# EAGLE design ProtoShield-I2C-PW-1.0.b (EAGLE 5.10)
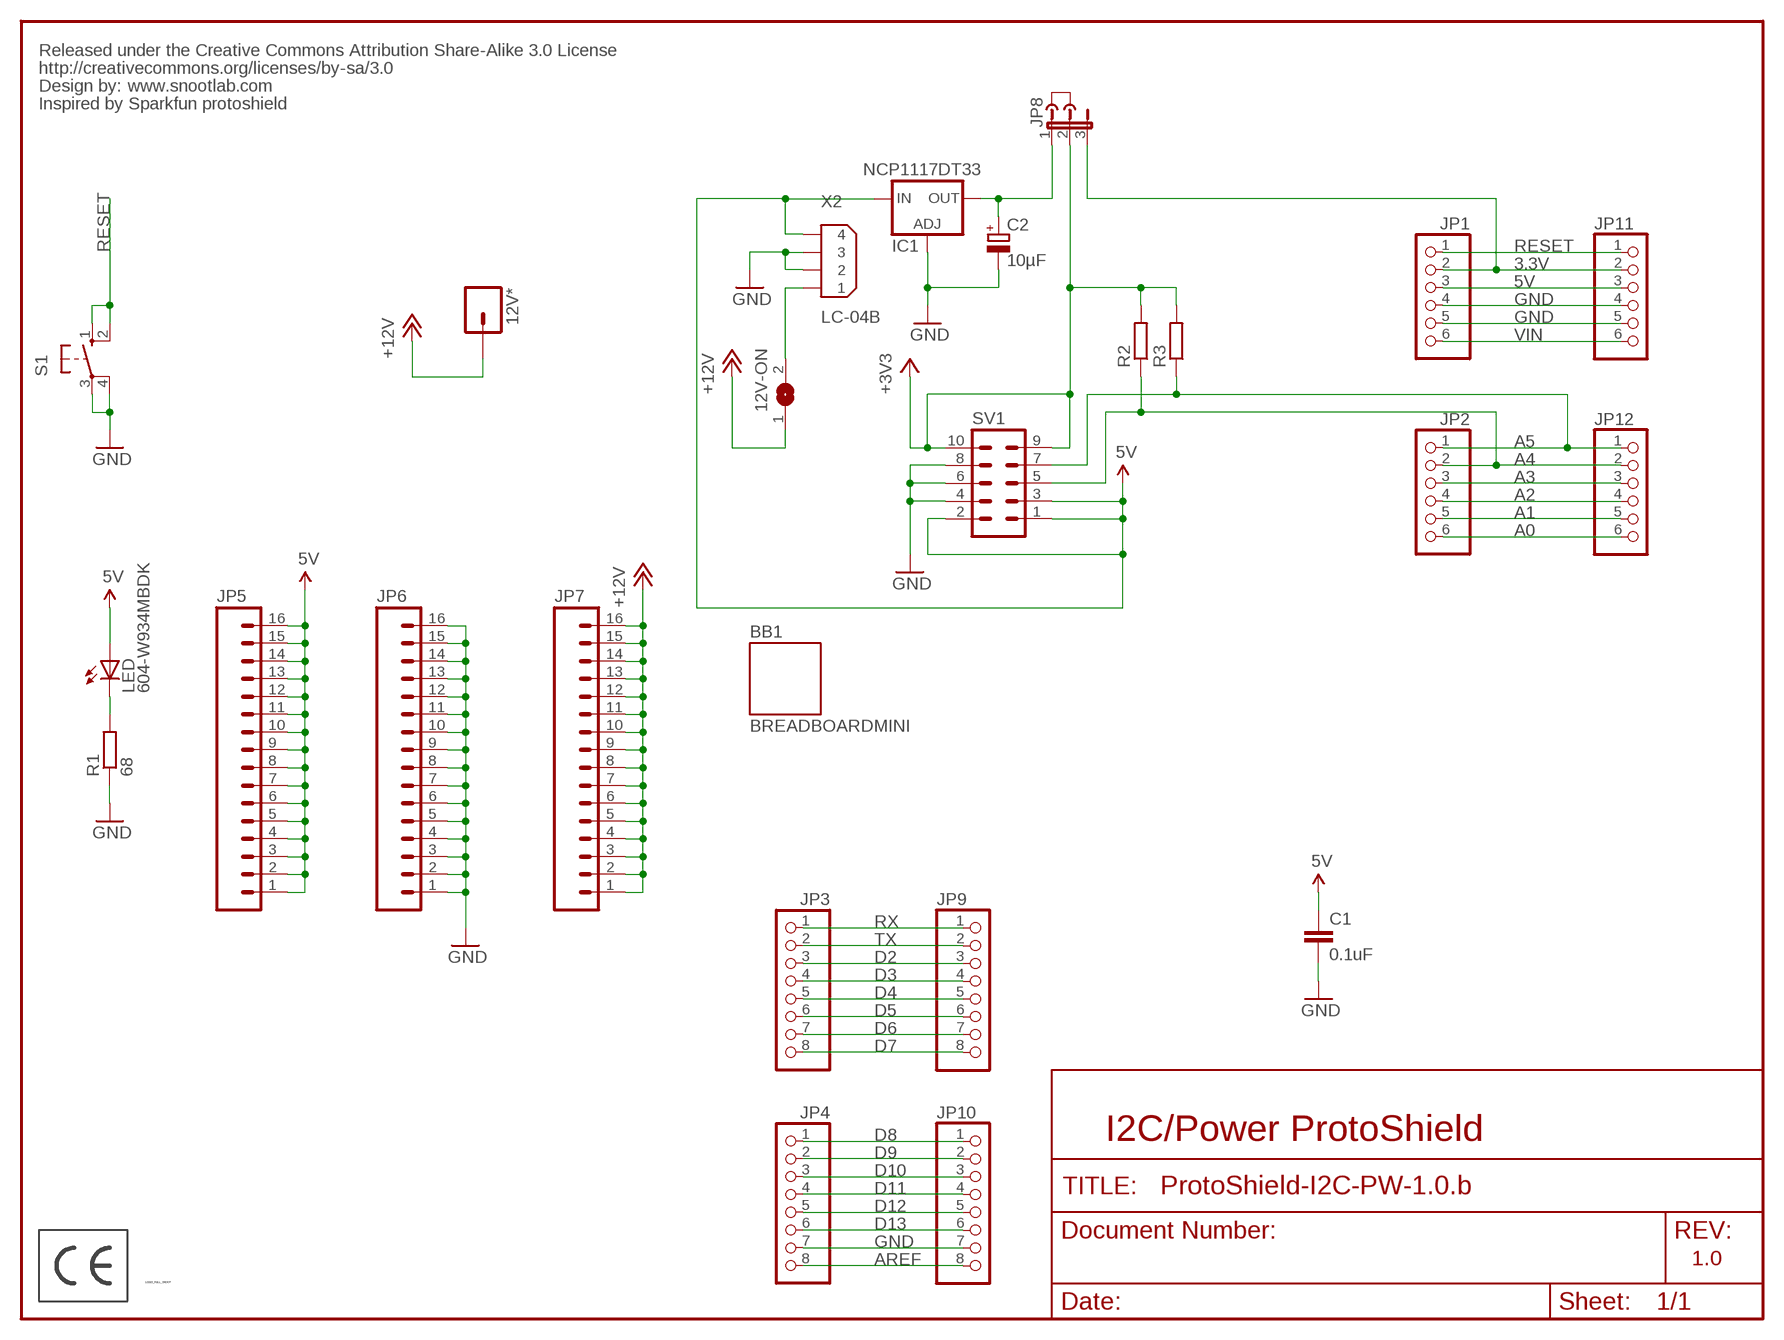
[diagram p0: schematic, sheet 1]

## Parts
12V*  M01PTH  [1X01]
12V-ON  SJ  [SJ]
BB1  BREADBOARDMINI  [BREADBOARD-MINI]
C1  0.1uF  C-EU050-025X075  [C050-025X075]
C2  10µF  CPOL-EUE2-5  [E2-5]
IC1  NCP1117DT33  LD117ADT-TR  [DPACK]
J1  JUMPER  [JUMP]
JP1  PINHD-1X6NOPIN  [1X06_NOPIN]
JP2  PINHD-1X6NOPIN  [1X06_NOPIN]
JP3  PINHD-1X8NOPIN  [1X08_NOPIN]
JP4  PINHD-1X8NOPIN  [1X08_NOPIN]
JP5  M16NOPIN  [1X16_NOPIN]
JP6  M16NOPIN  [1X16_NOPIN]
JP7  M16NOPIN  [1X16_NOPIN]
JP8  JP2E  [JP2]
JP9  PINHD-1X8/STACK  [1X08_STACK]
JP10  PINHD-1X8/STACK  [1X08_STACK]
JP11  PINHD-1X6/STACK  [1X06_STACK]
JP12  PINHD-1X6/STACK  [1X06_STACK]
LED  604-W934MBDK  LED3MM  [LED3MM]
R1  68  R-EU_0207/7  [0207/7]
R2  R-EU_0207/2V  [0207/2V]
R3  R-EU_0207/2V  [0207/2V]
S1  10-XX  [B3F-10XX]
SV1  ML10L  [ML10L]
U$1  CE_LOGO  [CE6.35X5.08_TOP]
U$2  LOGO_SNOOTLABH6.35  [LOGO_SNOOT_H6.35]
U$3  LOGO_SNOOTLABFULL_H5  [LOGO_SNOOT_FULL_H5]
U$5  CREATIVE_COMMONS  [CREATIVE_COMMONS]
X2  LC-04B  [LC-04B]

## Nets
3.3V: JP1.2 JP8.3 JP11.2
5V [power]: C1.1 IC1.3(IN) JP1.3 JP5.1 JP5.2 JP5.3 JP5.4 JP5.5 JP5.6 JP5.7 JP5.8 JP5.9 JP5.10 JP5.11 JP5.12 JP5.13 JP5.14 JP5.15 JP5.16 JP11.3 LED.A SV1.1 SV1.2 SV1.3 X2.4
+3V3: JP8.2 R2.2 R3.2 SV1.9 SV1.10
+12V [power]: 12V*.1 12V-ON.1 JP7.1 JP7.2 JP7.3 JP7.4 JP7.5 JP7.6 JP7.7 JP7.8 JP7.9 JP7.10 JP7.11 JP7.12 JP7.13 JP7.14 JP7.15 JP7.16
A0: JP2.6 JP12.6
A1: JP2.5 JP12.5
A2: JP2.4 JP12.4
A3: JP2.3 JP12.3
A4: JP2.2 JP12.2 R2.1 SV1.5
A5: JP2.1 JP12.1 R3.1 SV1.7
AREF: JP4.8 JP10.8
D2: JP3.3 JP9.3
D3: JP3.4 JP9.4
D4: JP3.5 JP9.5
D5: JP3.6 JP9.6
D6: JP3.7 JP9.7
D7: JP3.8 JP9.8
D8: JP4.1 JP10.1
D9: JP4.2 JP10.2
D10: JP4.3 JP10.3
D11: JP4.4 JP10.4
D12: JP4.5 JP10.5
D13: JP4.6 JP10.6
GND [power]: C1.2 C2.- IC1.1(ADJ) JP1.4 JP1.5 JP4.7 JP6.1 JP6.2 JP6.3 JP6.4 JP6.5 JP6.6 JP6.7 JP6.8 JP6.9 JP6.10 JP6.11 JP6.12 JP6.13 JP6.14 JP6.15 JP6.16 JP10.7 JP11.4 JP11.5 R1.1 S1.3(P) S1.4(P1) SV1.4 SV1.6 SV1.8 X2.2 X2.3
N$3 [power]: 12V-ON.2 X2.1
N$6: LED.K(C) R1.2
N$7: C2.+ IC1.4(OUT) JP8.1
RESET: JP1.1 JP11.1 S1.1(S) S1.2(S1)
RX: JP3.1 JP9.1
TX: JP3.2 JP9.2
VIN [power]: JP1.6 JP11.6

## Notes on the sheet
- www.snootlab.com
- Inspired by Sparkfun protoshield
- I2C/Power ProtoShield
- 1.0

## Library data of the parts
12V* = SparkFun:M01: Header 1 Standard 1-pin 0.1" header. Use with straight break away headers (SKU : PRT-00116), right angle break away headers (PRT-00553), swiss pins (PRT-00743), machine pins (PRT-00117), and female headers (PRT-00115).
12V-ON = jumper:SJ: SMD solder JUMPER
BB1 = SparkFun:BREADBOARD: Breadboard Mini Self Adhesive This is the mechnical outline for the very small self adhesive breadboard from SparkFun Electronics. Good for very small proto areas. SKU : PRT-07916
C1 = rcl:C-EU: CAPACITOR, European symbol
C2 = rcl:CPOL-EU: POLARIZED CAPACITOR, European symbol
IC1 = v-reg:LD117A?*: Low drop fixed and adjustable positive voltage regulators 1 A Source: http://www.st.com/stonline/products/literature/ds/7194/ld1117axx.pdf
J1 = jumper:JUMPER: JUMPER header
JP1 JP2 JP11 JP12 = SnootLib:PINHD-1X6: PIN HEADER
JP3 JP4 JP9 JP10 = SnootLib:PINHD-1X8: PIN HEADER
JP5-JP7 = SnootLib:M16
JP8 = jumper:JP2E: JUMPER
LED = SparkFun:LED: LEDs Standard schematic elements and footprints for 5mm, 3mm, 1206, and 0603 sized LEDs. 5mm - Spark Fun Electronics SKU : COM-00529 (and others)
R1-R3 = rcl:R-EU_: RESISTOR, European symbol
S1 = switch-omron:10-XX: OMRON SWITCH
SV1 = con-harting-ml:ML10: HARTING
U$1 = SnootLib:CE_LOGO: Logo CE
U$2 U$3 = SnootLib:LOGO_SNOOTLAB
U$5 = SnootLib:CREATIVE_COMMONS
X2 = SnootLib:LC-04: Disk Drive Power four position Source: JST LC Connector

## Net classes
1 power: width 0.254 mm

## Board
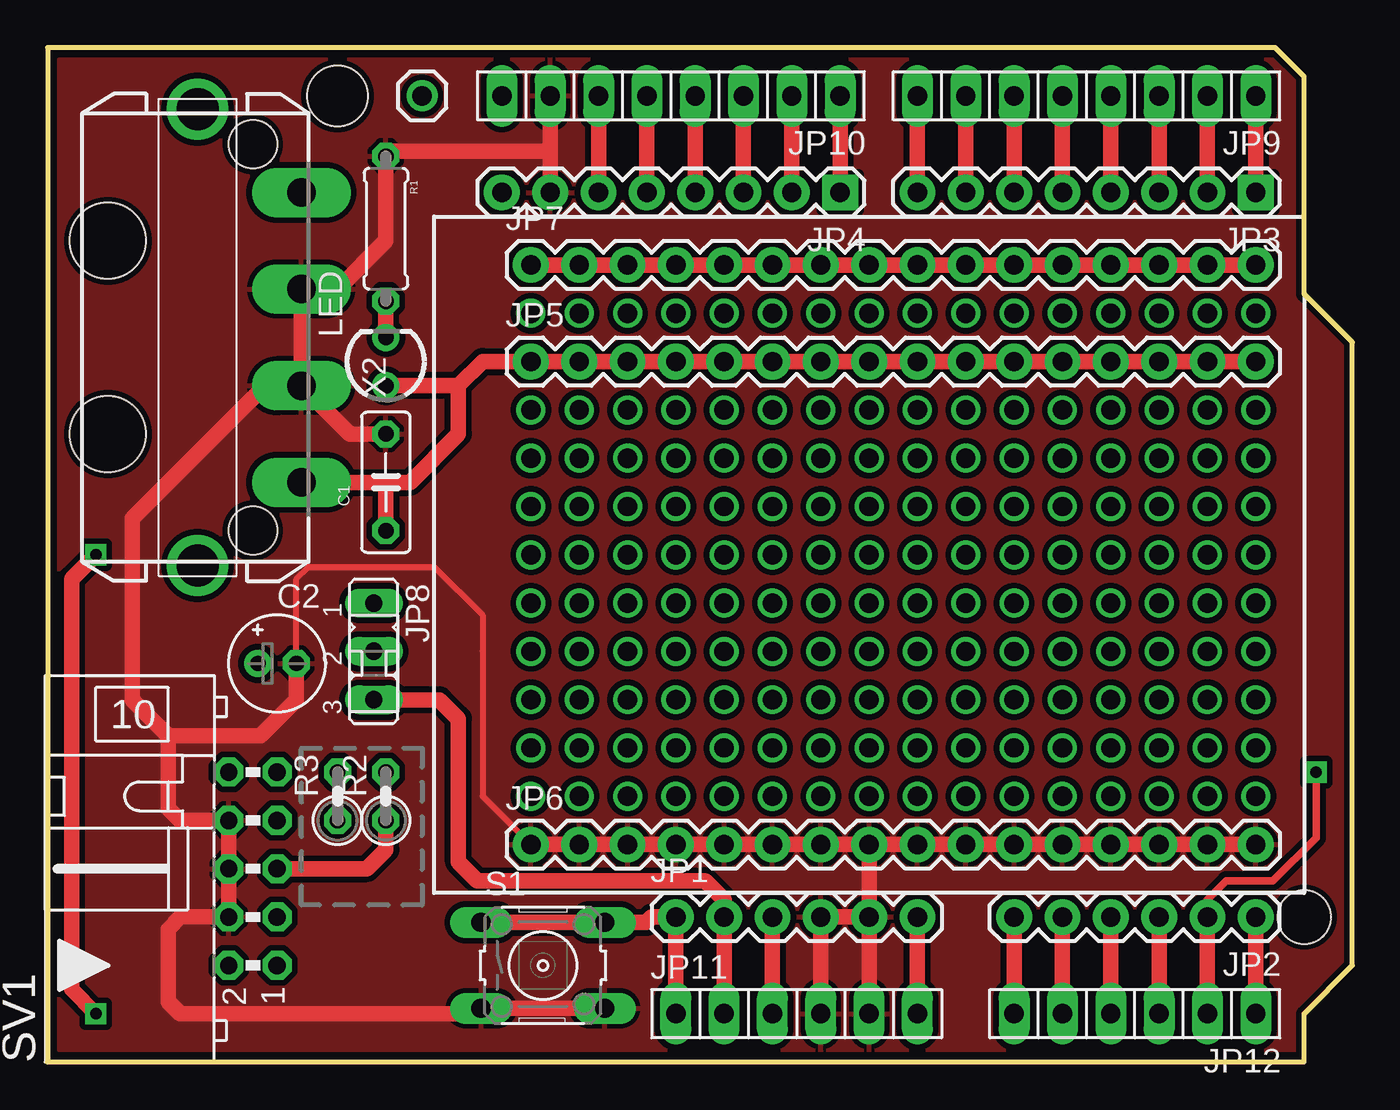
[diagram p1: board, top side]
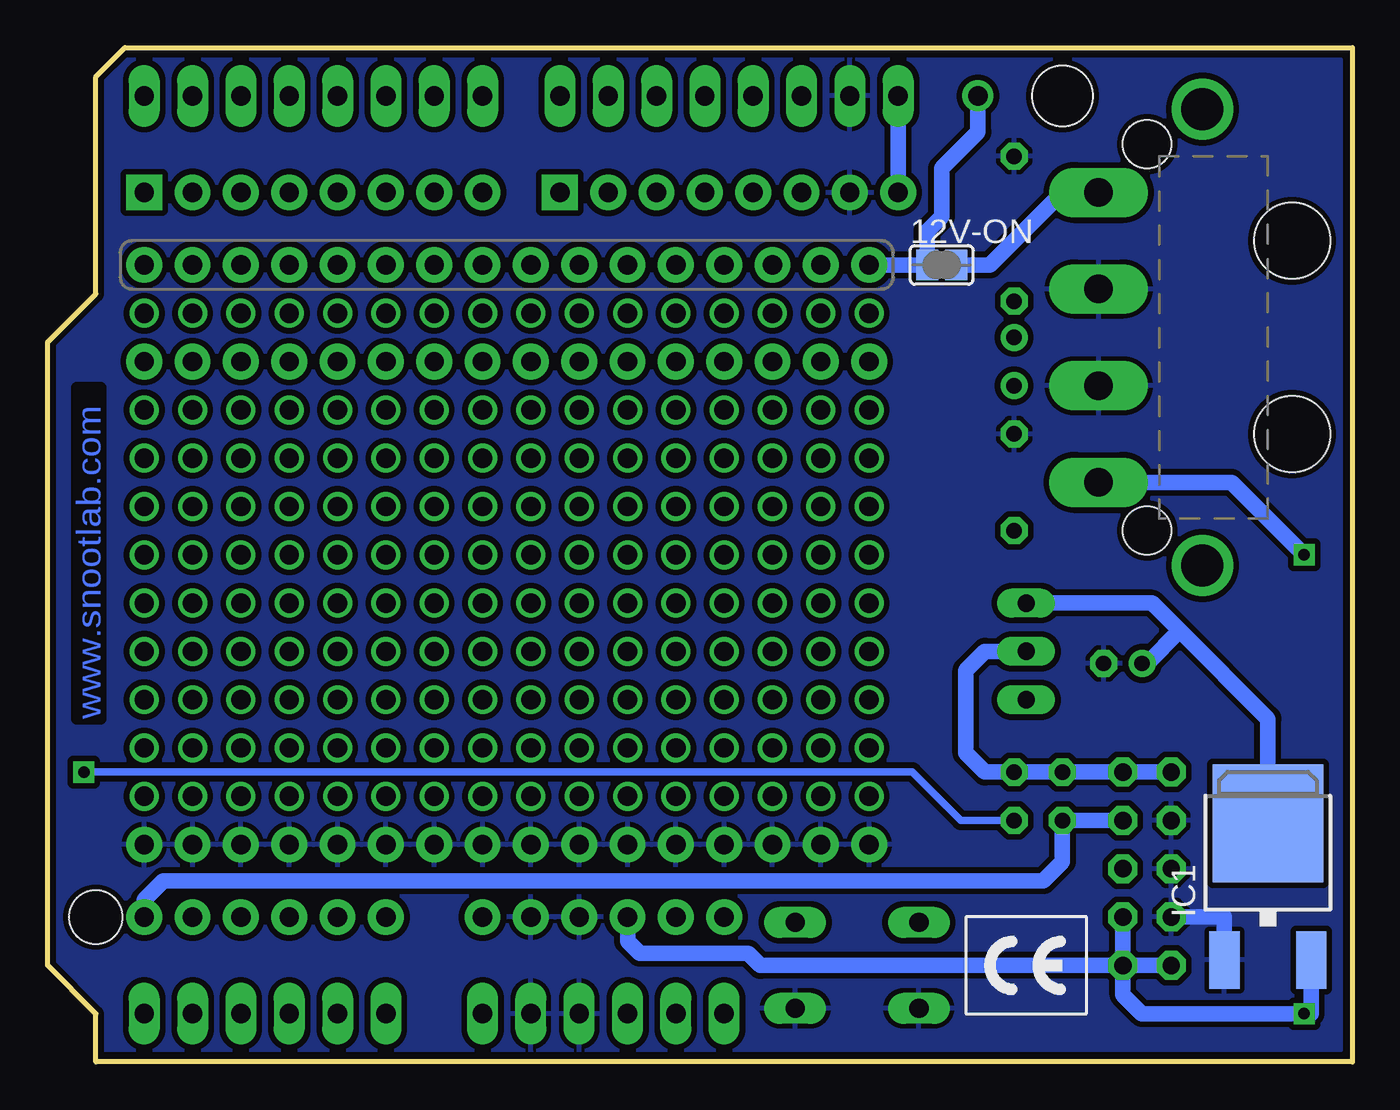
[diagram p2: board, bottom side, seen from below]

Size 68.58 x 53.34 mm. Coordinates in mm from the lower left corner, seen from the top.
Outline: 0,0 66.04,0 66.04,2.54 68.58,5.08 68.58,37.85 66.04,40.39 66.04,51.82 64.52,53.34 0,53.34 0,0
Copper layers (1*16): Top 0.035mm / dielectric 1.5mm / Bottom 0.035mm
Design rules "SparkFun": minimum track width 8mil, minimum drill 20mil, track to track 8mil, track to pad 8mil, pad to pad 8mil, via to via 8mil, smd to smd 8mil, copper to edge 10mil, drill to drill 8mil, minimum pad ring 12mil, minimum via ring 10mil, stop-mask expansion 4mil, vias tented up to drill 25mil, thermal gap 10mil
Holes 2.8 mm at 66.04,7.62
Holes 3.2 mm at 15.24,50.8
Holes 4 mm at 3.17,43.18 3.17,33.02
Holes 2.54 mm at 10.79,27.94 10.79,48.26

### Footprints (pad centres in the part's own frame; a part is rotated, then mirrored left to right if it is on the bottom)
1X01 = drill 1.016 round: 1 0,0
SJ = smd 1.168 x 1.6: 1 -0.762,0; 2 0.762,0
C050-025X075 = drill 0.813 octagon: 1 -2.54,0; 2 2.54,0
E2-5 = drill 0.813 pad 1.27 round: + -1.016,0 | drill 0.813 pad 1.27 octagon: - 1.016,0
DPACK = smd 1.6 x 3: 1 -2.28,-4.8; 3 2.28,-4.8 | smd 5.8 x 6.2: 4 0,2.38
1X06_NOPIN = drill 1.016 pad 1.88 round: 1 0,0; 2 2.54,0; 3 5.08,0; 4 7.62,0; 5 10.16,0; 6 12.7,0
1X08_NOPIN = drill 1.016 pad 1.88 square: 1 0,0 | drill 1.016 pad 1.88 round: 2 2.54,0; 3 5.08,0; 4 7.62,0; 5 10.16,0; 6 12.7,0; 7 15.24,0; 8 17.78,0
1X16_NOPIN = drill 1.016 pad 1.88 round: 1 0,0; 2 2.54,0; 3 5.08,0; 4 7.62,0; 5 10.16,0; 6 12.7,0; 7 15.24,0; 8 17.78,0; 9 20.32,0; 10 22.86,0; 11 25.4,0; 12 27.94,0; 13 30.48,0; 14 33.02,0; 15 35.56,0; 16 38.1,0
JP2 = drill 0.914 long: 1 -2.54,0; 2 0,0; 3 2.54,0
1X08_STACK = drill 1.016 long: 1 -8.89,0; 2 -6.35,0; 3 -3.81,0; 4 -1.27,0; 5 1.27,0; 6 3.81,0; 7 6.35,0; 8 8.89,0
1X06_STACK = drill 1.016 long: 1 -6.35,0; 2 -3.81,0; 3 -1.27,0; 4 1.27,0; 5 3.81,0; 6 6.35,0
LED3MM = drill 0.813 round: A -1.27,0; K 1.27,0
0207/7 = drill 0.813 octagon: 1 -3.81,0; 2 3.81,0
0207/2V = drill 0.813 octagon: 1 -1.27,0; 2 1.27,0
B3F-10XX = drill 1.016 long: 1 -3.251,2.261; 2 3.251,2.261; 3 -3.251,-2.261; 4 3.251,-2.261
ML10L = drill 0.914 octagon: 1 -5.08,-1.27; 2 -5.08,1.27; 3 -2.54,-1.27; 4 -2.54,1.27; 5 0,-1.27; 6 0,1.27; 7 2.54,-1.27; 8 2.54,1.27; 9 5.08,-1.27; 10 5.08,1.27
LC-04B = drill 1.5 pad 2.6 long: 1 7.62,0; 2 2.54,0; 3 -2.54,0; 4 -7.62,0 | drill 2.2 round: P$1 12,5.45; P$2 -12,5.45

### Placement (x,y rotation side)
12V*  19.68,50.8 0 top
12V-ON  21.59,41.91 0 bottom
BB1  20.32,8.89 0 top
C1  17.78,30.48 90 top
C2  12.06,20.95 0 top
IC1  4.45,10.16 0 bottom
J1  17.14,20.95 180 top
JP1  33.02,7.62 0 top
JP2  63.5,7.62 180 top
JP3  63.5,45.72 180 top
JP4  41.66,45.72 180 top
JP5  25.4,36.83 0 top
JP6  25.4,11.43 0 top
JP7  25.4,41.91 0 top
JP8  17.14,21.59 270 top
JP9  54.61,50.8 180 top
JP10  32.77,50.8 180 top
JP11  39.37,2.54 0 top
JP12  57.15,2.54 180 top
LED  17.78,36.83 90 top
R1  17.78,43.81 270 top
R2  17.78,13.97 90 top
R3  15.24,13.97 90 top
S1  26.04,5.08 0 top
SV1  10.79,10.16 90 top
U$1  20.32,2.54 0 bottom
U$2  13.34,1.27 0 top
U$3  19.68,9.53 90 bottom
U$4  LOGO_SNOOTLABTXT_H1.7  [LOGO_SNOOT_TXT_H1.7]  67.94,17.78 90 top
U$5  2.54,-8.89 0 top  (outside the outline)
X2  13.34,38.1 90 top

### Tracks (layer width: path | path; a pad name or v marks a point on that pad's centre or on a via)
3.3V
  Top 0.813: JP11.2 JP1.2 35.56,8.53 34.56,9.53 22.59,9.53 21.59,10.53 21.59,18.05 20.59,19.05 JP8.3
5V  (via drill 0.6)
  Top 0.813: JP5.16 JP5.15 JP5.14 JP5.13 JP5.12 JP5.11 JP5.10 JP5.9 JP5.8 JP5.7 JP5.6 JP5.5 JP5.4 JP5.3 JP5.2 JP5.1 22.86,36.83 21.59,35.56 | JP1.3 JP11.3 | v2.54,2.54 1.27,3.81 1.27,25.4 v2.54,26.67 | X2.4 17.78,30.48 | 21.59,35.56 21.59,33.02 19.05,30.48 17.78,30.48 | 17.78,30.48 C1.1 | 21.59,35.56 LED.A
  Bottom 0.813: SV1.1 SV1.3 | SV1.1 12.06,3.54 11.06,2.54 v2.54,2.54 2.17,2.54 IC1.3 | SV1.1 SV1.2 | SV1.1 31.11,5.08 31.75,5.71 37.47,5.71 38.1,6.35 JP1.3 | X2.4 6.35,30.48 v2.54,26.67
+3V3
  Bottom 0.813: SV1.10 SV1.9 R3.2 R2.2 19.32,15.24 20.32,16.24 20.32,20.59 19.32,21.59 JP8.2
+12V
  Top 0.813: JP7.16 JP7.15 JP7.14 JP7.13 JP7.12 JP7.11 JP7.10 JP7.9 JP7.8 JP7.7 JP7.6 JP7.5 JP7.4 JP7.3 JP7.2 JP7.1
  Bottom 0.813: JP7.1 12V-ON.1 22.35,43.69 21.59,44.45 21.59,46.99 19.68,48.9 12V*.1
A0
  Top 0.813: JP12.6 JP2.6
A1
  Top 0.813: JP12.5 JP2.5
A2
  Top 0.813: JP12.4 JP2.4
A3
  Top 0.813: JP12.3 JP2.3
A4  (via drill 0.6)
  Top 0.406: JP2.2 60.96,8.53 61.96,9.53 64.41,9.53 66.67,11.79 v66.67,15.24
  Top 0.813: JP2.2 JP12.2 | SV1.5 16.78,10.16 17.78,11.16 R2.1
  Bottom 0.406: R2.1 20.59,12.7 23.13,15.24 v66.67,15.24
A5
  Top 0.813: JP2.1 JP12.1
  Bottom 0.813: SV1.7 R3.1 15.24,10.53 16.24,9.53 62.5,9.53 63.5,8.53 JP2.1
AREF
  Bottom 0.813: JP4.8 JP10.8
D2
  Top 0.813: JP3.3 JP9.3
D3
  Top 0.813: JP3.4 JP9.4
D4
  Top 0.813: JP3.5 JP9.5
D5
  Top 0.813: JP3.6 JP9.6
D6
  Top 0.813: JP3.7 JP9.7
D7
  Top 0.813: JP3.8 JP9.8
D8
  Top 0.813: JP4.1 JP10.1
D9
  Top 0.813: JP4.2 JP10.2
D10
  Top 0.813: JP4.3 JP10.3
D11
  Top 0.813: JP4.4 JP10.4
D12
  Top 0.813: JP4.5 JP10.5
D13
  Top 0.813: JP4.6 JP10.6
GND
  Top 0.305: JP6.1 22.86,13.97 22.86,21.59 22.86,23.5 20.32,26.04 13.72,26.04 13.08,25.4 C2.-
  Top 0.813: 26.42,47.89 JP4.7 | 26.42,47.89 JP10.7 | JP11.4 JP1.4 JP1.5 | JP1.5 JP11.5 | JP6.1 JP6.2 JP6.3 JP6.4 JP6.5 JP6.6 JP6.7 JP6.8 | JP6.8 JP6.9 JP6.10 JP6.11 JP6.12 JP6.13 JP6.14 JP6.15 JP6.16 | 6.35,17.14 6.35,13.34 6.99,12.7 SV1.8 SV1.6 SV1.4 6.99,7.62 6.35,6.99 6.35,3.17 6.99,2.54 22.5,2.54 S1.3 S1.4 | 6.35,17.14 11.18,17.14 13.08,19.05 C2.- | JP6.8 JP1.5 | X2.3 11.43,35.56 4.45,28.57 4.45,19.05 6.35,17.14 | X2.3 X2.2 15.24,40.64 17.78,43.18 R1.1 18.05,47.89 26.42,47.89 | C1.2 15.88,33.02 X2.3
  Bottom 0.813: SV1.4 6.72,7.62 IC1.1
  pour Bottom (isolate 0.305): 0.64,52.7 0.64,0.64 71.12,0.64 71.12,52.7
  pour Top (isolate 0.305): 69.85,52.7 69.85,0.64 0.64,0.64 0.64,52.7
N$3
  Bottom 0.813: 12V-ON.2 19.05,41.91 15.24,45.72 X2.1
N$4  (via drill 1.02)
  other vias: 63.5,39.37
N$5  (via drill 1.02)
  other vias: 63.5,13.97
N$6
  Top 0.813: LED.K R1.2
N$7
  Bottom 0.813: IC1.4 4.45,18.05 9.07,22.68 | JP8.1 10.53,24.13 9.07,22.68 | C2.+ 10.79,20.95 9.07,22.68
N$10  (via drill 1.02)
  other vias: 63.5,16.51
N$11  (via drill 1.02)
  other vias: 63.5,19.05
N$12  (via drill 1.02)
  other vias: 63.5,21.59
N$13  (via drill 1.02)
  other vias: 63.5,24.13
N$14  (via drill 1.02)
  other vias: 63.5,26.67
N$15  (via drill 1.02)
  other vias: 63.5,29.21
N$16  (via drill 1.02)
  other vias: 63.5,31.75
N$17  (via drill 1.02)
  other vias: 63.5,34.29
N$19  (via drill 1.02)
  other vias: 60.96,39.37
N$20  (via drill 1.02)
  other vias: 60.96,13.97
N$21  (via drill 1.02)
  other vias: 60.96,16.51
N$22  (via drill 1.02)
  other vias: 60.96,19.05
N$23  (via drill 1.02)
  other vias: 60.96,21.59
N$24  (via drill 1.02)
  other vias: 60.96,24.13
N$25  (via drill 1.02)
  other vias: 60.96,26.67
N$26  (via drill 1.02)
  other vias: 60.96,29.21
N$27  (via drill 1.02)
  other vias: 60.96,31.75
N$28  (via drill 1.02)
  other vias: 60.96,34.29
N$30  (via drill 1.02)
  other vias: 58.42,39.37
N$31  (via drill 1.02)
  other vias: 58.42,13.97
N$32  (via drill 1.02)
  other vias: 58.42,16.51
N$33  (via drill 1.02)
  other vias: 58.42,19.05
N$34  (via drill 1.02)
  other vias: 58.42,21.59
N$35  (via drill 1.02)
  other vias: 58.42,24.13
N$36  (via drill 1.02)
  other vias: 58.42,26.67
N$37  (via drill 1.02)
  other vias: 58.42,29.21
N$38  (via drill 1.02)
  other vias: 58.42,31.75
N$39  (via drill 1.02)
  other vias: 58.42,34.29
N$41  (via drill 1.02)
  other vias: 55.88,39.37
N$42  (via drill 1.02)
  other vias: 55.88,13.97
N$43  (via drill 1.02)
  other vias: 55.88,16.51
N$44  (via drill 1.02)
  other vias: 55.88,19.05
N$45  (via drill 1.02)
  other vias: 55.88,21.59
N$46  (via drill 1.02)
  other vias: 55.88,24.13
N$47  (via drill 1.02)
  other vias: 55.88,26.67
N$48  (via drill 1.02)
  other vias: 55.88,29.21
N$49  (via drill 1.02)
  other vias: 55.88,31.75
N$50  (via drill 1.02)
  other vias: 55.88,34.29
N$52  (via drill 1.02)
  other vias: 53.34,39.37
N$53  (via drill 1.02)
  other vias: 53.34,13.97
N$54  (via drill 1.02)
  other vias: 53.34,16.51
N$55  (via drill 1.02)
  other vias: 53.34,19.05
N$56  (via drill 1.02)
  other vias: 53.34,21.59
N$57  (via drill 1.02)
  other vias: 53.34,24.13
N$58  (via drill 1.02)
  other vias: 53.34,26.67
N$59  (via drill 1.02)
  other vias: 53.34,29.21
N$60  (via drill 1.02)
  other vias: 53.34,31.75
N$61  (via drill 1.02)
  other vias: 53.34,34.29
N$63  (via drill 1.02)
  other vias: 50.8,39.37
N$64  (via drill 1.02)
  other vias: 50.8,13.97
N$65  (via drill 1.02)
  other vias: 50.8,16.51
N$66  (via drill 1.02)
  other vias: 50.8,19.05
N$67  (via drill 1.02)
  other vias: 50.8,21.59
N$68  (via drill 1.02)
  other vias: 50.8,24.13
N$69  (via drill 1.02)
  other vias: 50.8,26.67
N$70  (via drill 1.02)
  other vias: 50.8,29.21
N$71  (via drill 1.02)
  other vias: 50.8,31.75
N$72  (via drill 1.02)
  other vias: 50.8,34.29
N$74  (via drill 1.02)
  other vias: 48.26,39.37
N$75  (via drill 1.02)
  other vias: 48.26,13.97
N$76  (via drill 1.02)
  other vias: 48.26,16.51
N$77  (via drill 1.02)
  other vias: 48.26,19.05
N$78  (via drill 1.02)
  other vias: 48.26,21.59
N$79  (via drill 1.02)
  other vias: 48.26,24.13
N$80  (via drill 1.02)
  other vias: 48.26,26.67
N$81  (via drill 1.02)
  other vias: 48.26,29.21
N$82  (via drill 1.02)
  other vias: 48.26,31.75
N$83  (via drill 1.02)
  other vias: 48.26,34.29
N$85  (via drill 1.02)
  other vias: 45.72,39.37
N$86  (via drill 1.02)
  other vias: 45.72,13.97
N$87  (via drill 1.02)
  other vias: 45.72,16.51
N$88  (via drill 1.02)
  other vias: 45.72,19.05
N$89  (via drill 1.02)
  other vias: 45.72,21.59
N$90  (via drill 1.02)
  other vias: 45.72,24.13
N$91  (via drill 1.02)
  other vias: 45.72,26.67
N$92  (via drill 1.02)
  other vias: 45.72,29.21
N$93  (via drill 1.02)
  other vias: 45.72,31.75
N$94  (via drill 1.02)
  other vias: 45.72,34.29
N$96  (via drill 1.02)
  other vias: 43.18,39.37
N$97  (via drill 1.02)
  other vias: 43.18,13.97
N$98  (via drill 1.02)
  other vias: 43.18,16.51
N$99  (via drill 1.02)
  other vias: 43.18,19.05
N$100  (via drill 1.02)
  other vias: 43.18,21.59
N$101  (via drill 1.02)
  other vias: 43.18,24.13
N$102  (via drill 1.02)
  other vias: 43.18,26.67
N$103  (via drill 1.02)
  other vias: 43.18,29.21
N$104  (via drill 1.02)
  other vias: 43.18,31.75
N$105  (via drill 1.02)
  other vias: 43.18,34.29
N$107  (via drill 1.02)
  other vias: 40.64,39.37
N$108  (via drill 1.02)
  other vias: 40.64,13.97
N$109  (via drill 1.02)
  other vias: 40.64,16.51
N$110  (via drill 1.02)
  other vias: 40.64,19.05
N$111  (via drill 1.02)
  other vias: 40.64,21.59
N$112  (via drill 1.02)
  other vias: 40.64,24.13
N$113  (via drill 1.02)
  other vias: 40.64,26.67
N$114  (via drill 1.02)
  other vias: 40.64,29.21
N$115  (via drill 1.02)
  other vias: 40.64,31.75
N$116  (via drill 1.02)
  other vias: 40.64,34.29
N$118  (via drill 1.02)
  other vias: 38.1,39.37
N$119  (via drill 1.02)
  other vias: 38.1,13.97
N$120  (via drill 1.02)
  other vias: 38.1,16.51
N$121  (via drill 1.02)
  other vias: 38.1,19.05
N$122  (via drill 1.02)
  other vias: 38.1,21.59
N$123  (via drill 1.02)
  other vias: 38.1,24.13
N$124  (via drill 1.02)
  other vias: 38.1,26.67
N$125  (via drill 1.02)
  other vias: 38.1,29.21
N$126  (via drill 1.02)
  other vias: 38.1,31.75
N$127  (via drill 1.02)
  other vias: 38.1,34.29
N$129  (via drill 1.02)
  other vias: 35.56,39.37
N$130  (via drill 1.02)
  other vias: 35.56,13.97
N$131  (via drill 1.02)
  other vias: 35.56,16.51
N$132  (via drill 1.02)
  other vias: 35.56,19.05
N$133  (via drill 1.02)
  other vias: 35.56,21.59
N$134  (via drill 1.02)
  other vias: 35.56,24.13
N$135  (via drill 1.02)
  other vias: 35.56,26.67
N$136  (via drill 1.02)
  other vias: 35.56,29.21
N$137  (via drill 1.02)
  other vias: 35.56,31.75
N$138  (via drill 1.02)
  other vias: 35.56,34.29
N$140  (via drill 1.02)
  other vias: 33.02,39.37
N$141  (via drill 1.02)
  other vias: 33.02,13.97
N$142  (via drill 1.02)
  other vias: 33.02,16.51
N$143  (via drill 1.02)
  other vias: 33.02,19.05
N$144  (via drill 1.02)
  other vias: 33.02,21.59
N$145  (via drill 1.02)
  other vias: 33.02,24.13
N$146  (via drill 1.02)
  other vias: 33.02,26.67
N$147  (via drill 1.02)
  other vias: 33.02,29.21
N$148  (via drill 1.02)
  other vias: 33.02,31.75
N$149  (via drill 1.02)
  other vias: 33.02,34.29
N$151  (via drill 1.02)
  other vias: 30.48,39.37
N$152  (via drill 1.02)
  other vias: 30.48,13.97
N$153  (via drill 1.02)
  other vias: 30.48,16.51
N$154  (via drill 1.02)
  other vias: 30.48,19.05
N$155  (via drill 1.02)
  other vias: 30.48,21.59
N$156  (via drill 1.02)
  other vias: 30.48,24.13
N$157  (via drill 1.02)
  other vias: 30.48,26.67
N$158  (via drill 1.02)
  other vias: 30.48,29.21
N$159  (via drill 1.02)
  other vias: 30.48,31.75
N$160  (via drill 1.02)
  other vias: 30.48,34.29
N$162  (via drill 1.02)
  other vias: 27.94,39.37
N$163  (via drill 1.02)
  other vias: 27.94,13.97
N$164  (via drill 1.02)
  other vias: 27.94,16.51
N$165  (via drill 1.02)
  other vias: 27.94,19.05
N$166  (via drill 1.02)
  other vias: 27.94,21.59
N$167  (via drill 1.02)
  other vias: 27.94,24.13
N$168  (via drill 1.02)
  other vias: 27.94,26.67
N$169  (via drill 1.02)
  other vias: 27.94,29.21
N$170  (via drill 1.02)
  other vias: 27.94,31.75
N$171  (via drill 1.02)
  other vias: 27.94,34.29
N$173  (via drill 1.02)
  other vias: 25.4,39.37
N$174  (via drill 1.02)
  other vias: 25.4,13.97
N$175  (via drill 1.02)
  other vias: 25.4,16.51
N$176  (via drill 1.02)
  other vias: 25.4,19.05
N$177  (via drill 1.02)
  other vias: 25.4,21.59
N$178  (via drill 1.02)
  other vias: 25.4,24.13
N$179  (via drill 1.02)
  other vias: 25.4,26.67
N$180  (via drill 1.02)
  other vias: 25.4,29.21
N$181  (via drill 1.02)
  other vias: 25.4,31.75
N$182  (via drill 1.02)
  other vias: 25.4,34.29
RESET
  Top 0.813: S1.1 S1.2 31.47,7.34 31.75,7.62 JP1.1 JP11.1 33.02,2.82
RX
  Top 0.813: JP3.1 JP9.1
TX
  Top 0.813: JP3.2 JP9.2
VIN
  Top 0.813: JP11.6 JP1.6

### Text on the board
Bottom: www.snootlab.com
tDocu: 12V | PWR | REF | GND | D13 | D12 | D11 | D10 | D9 | D8 | D7 | D6 | D5 | D4 | D3 | D2 | D1 | D0 | (12V) | 5V | EXT. POWER | I2C BUS | for Arduino | INT/EXT 3V3 | I2C POWER PROTOSHIELD | I2C | GND | Pull-Ups | 5 | RST | 3.3 | GND | GND | Vin | A0 | A1 | A2 | A3 | A4 | A5 | Reset | www.snootlab.com | Inspired by Sparkfun protoshield
bDocu: PWR | EXT. | board ! | 12V on | I2CPWR-1.0-2010 | POWERDUINO